# EAGLE schematic Vinduno-R-22-3-15 (EAGLE 7.1.0)
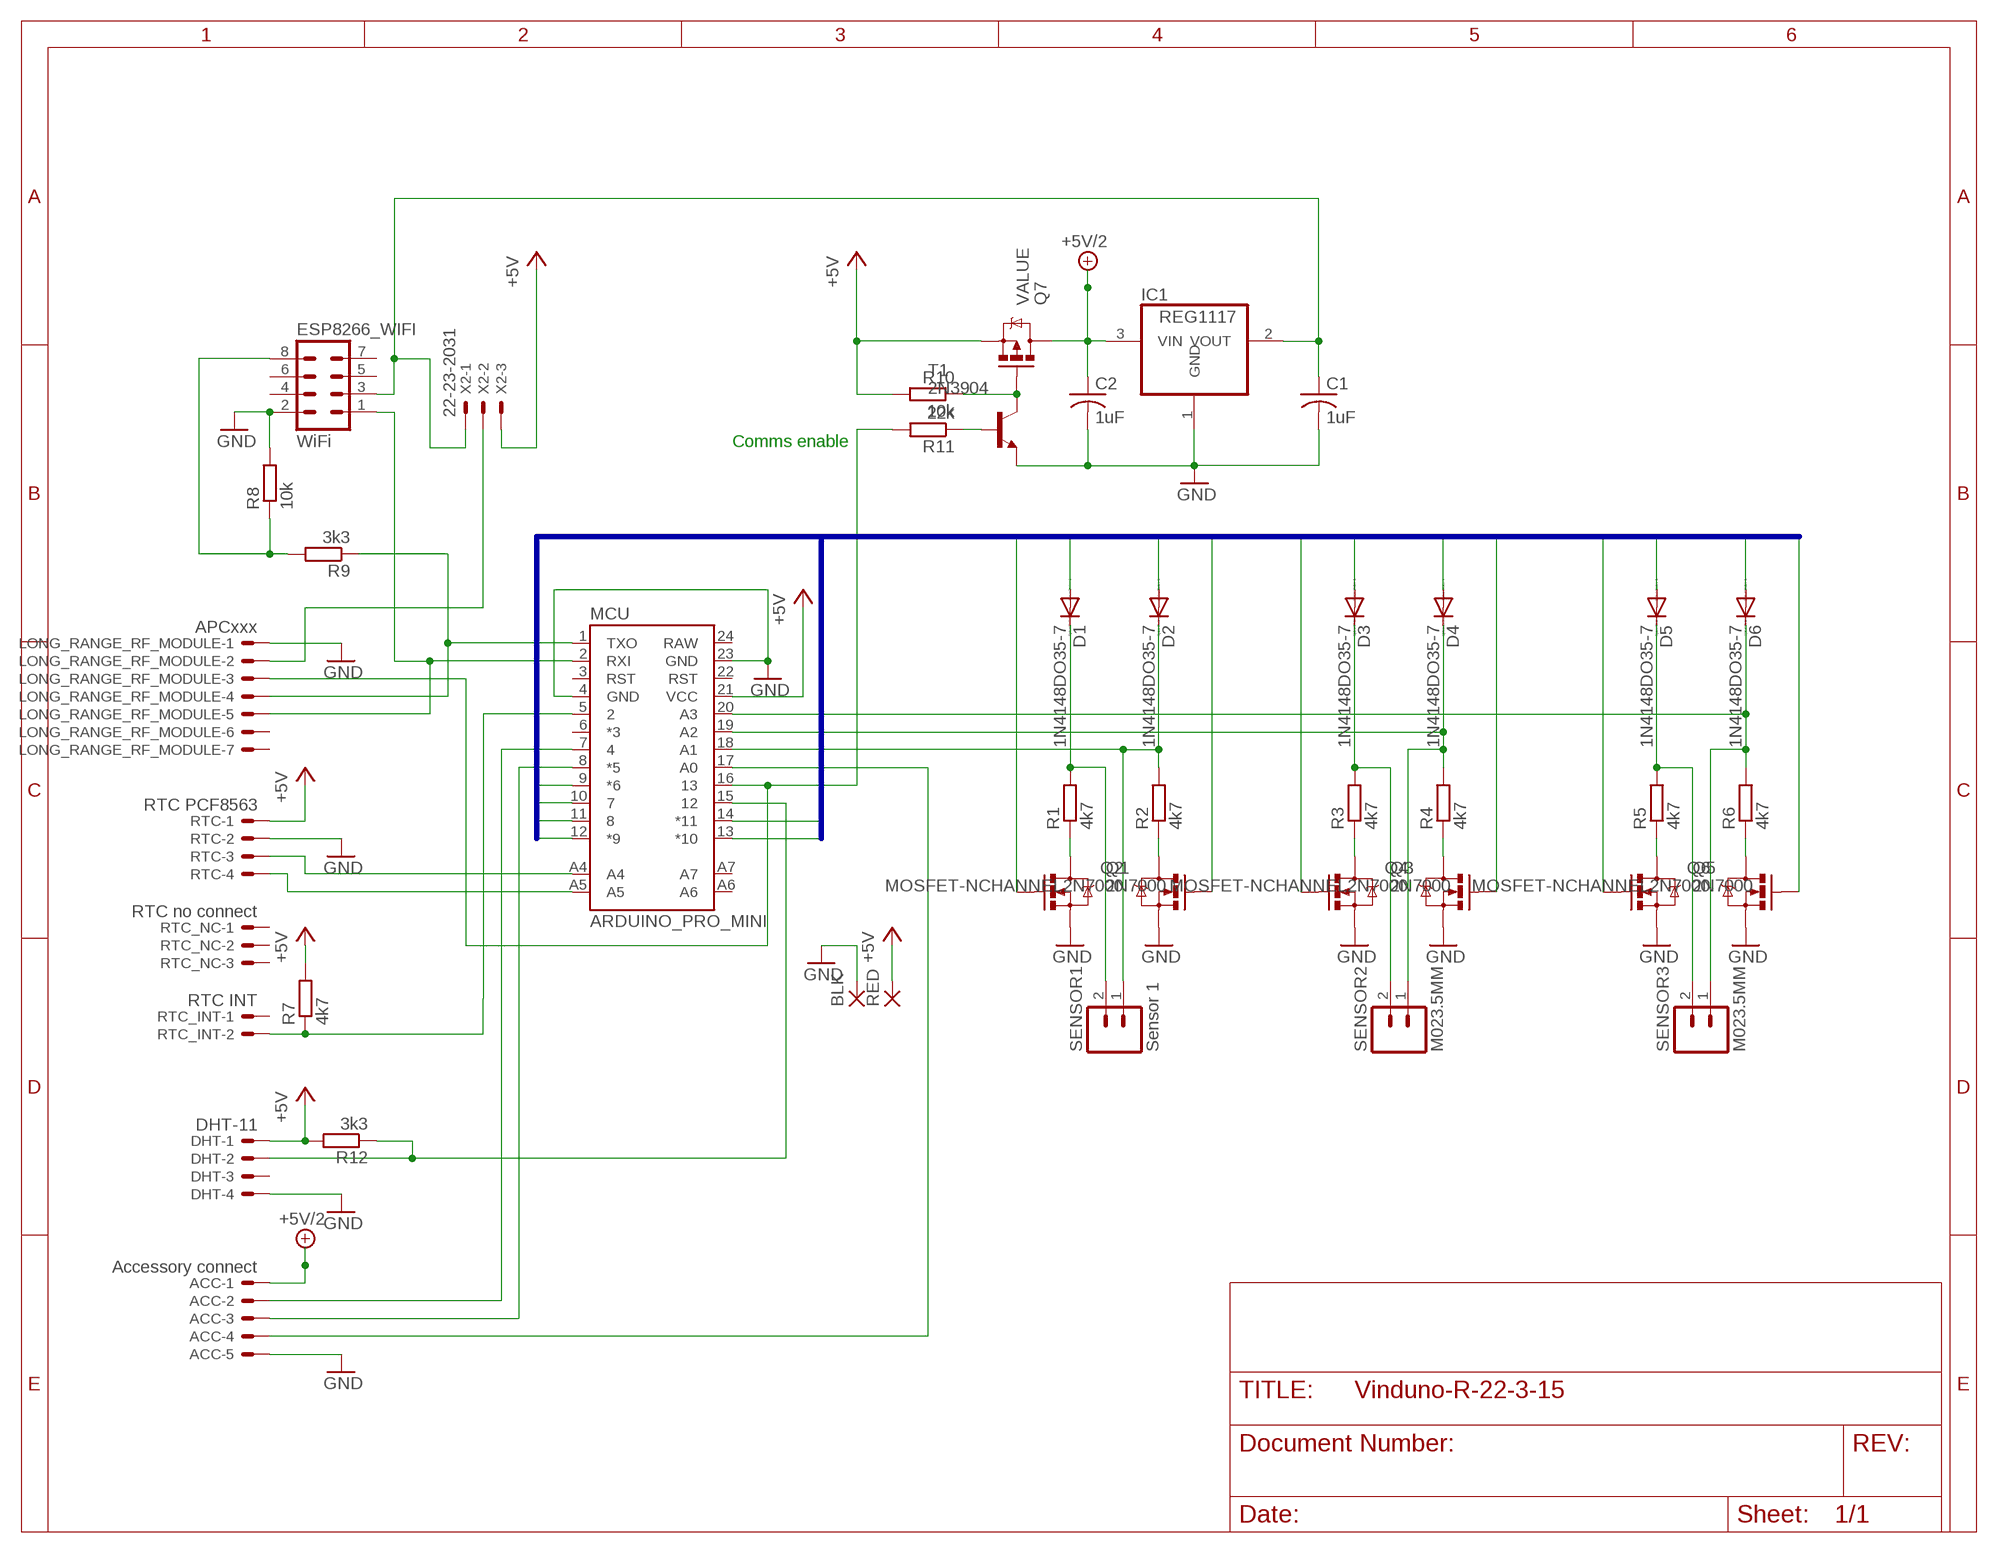
[diagram p0: schematic, sheet 1]

## Parts
ACC  Accessory connect  22-23-2051  [22-23-2051]
BLK  WIREPAD2,54/0,9  [2,54/0,9]
C1  1uF  C-US025-030X050  [C025-030X050]
C2  1uF  C-US025-030X050  [C025-030X050]
D1  1N4148DO35-7  [DO35-7]
D2  1N4148DO35-7  [DO35-7]
D3  1N4148DO35-7  [DO35-7]
D4  1N4148DO35-7  [DO35-7]
D5  1N4148DO35-7  [DO35-7]
D6  1N4148DO35-7  [DO35-7]
DHT  DHT-11  22-23-2041  [22-23-2041]
ESP8266_WIFI  WiFi  MA04-2  [MA04-2]
IC1  REG1117  [SOT223]
LONG_RANGE_RF_MODULE  APCxxx  22-23-2071  [22-23-2071]
MCU  ARDUINO_PRO_MINI  [ARDUINO_PRO_MINI]
Q1  2N7000  MOSFET-NCHANNEL2N7000  [TO-92]
Q2  MOSFET-NCHANNEL2N7000  [TO-92]
Q3  2N7000  MOSFET-NCHANNEL2N7000  [TO-92]
Q4  MOSFET-NCHANNEL2N7000  [TO-92]
Q5  2N7000  MOSFET-NCHANNEL2N7000  [TO-92]
Q6  MOSFET-NCHANNEL2N7000  [TO-92]
Q7  AO3401  MOSFET-PCHANNEL  [SOT23-3]
R1  4k7  R-EU_0204/7  [0204/7]
R2  4k7  R-EU_0204/7  [0204/7]
R3  4k7  R-EU_0204/7  [0204/7]
R4  4k7  R-EU_0204/7  [0204/7]
R5  4k7  R-EU_0204/7  [0204/7]
R6  4k7  R-EU_0204/7  [0204/7]
R7  4k7  R-EU_0204/7  [0204/7]
R8  10k  R-EU_0204/7  [0204/7]
R9  3k3  R-EU_0204/7  [0204/7]
R10  10k  R-EU_0204/7  [0204/7]
R11  22k  R-EU_0204/7  [0204/7]
R12  3k3  R-EU_0204/7  [0204/7]
RED  WIREPAD2,54/0,9  [2,54/0,9]
RTC  RTC PCF8563  22-23-2041  [22-23-2041]
RTC_INT  RTC INT  22-23-2021  [22-23-2021]
RTC_NC  RTC no connect  22-23-2031  [22-23-2031]
SENSOR1  Sensor 1  M023.5MM  [SCREWTERMINAL-3.5MM-2]
SENSOR2  M023.5MM  [SCREWTERMINAL-3.5MM-2]
SENSOR3  M023.5MM  [SCREWTERMINAL-3.5MM-2]
T1  2N3904  [TO92]
X2  22-23-2031  [22-23-2031]

## Nets
+5V [Supply]: DHT.1 MCU.21(VCC) Q7.2(S) R7.2 R10.2 R12.2 RED.1(P) RTC.1 X2.3
+5V/2 [Supply]: ACC.1 C2.1 IC1.3(VIN) Q7.3(D)
DIODE1: D1.A MCU.9(*6) Q2.2(G)
DIODE2: D2.A MCU.10 Q1.2(G)
DIODE3: D3.A MCU.11 Q4.2(G)
DIODE4: D4.A MCU.12(*9) Q3.2(G)
DIODE5: D5.A MCU.13(*10) Q6.2(G)
DIODE6: D6.A MCU.14(*11) Q5.2(G)
GND [Supply]: ACC.5 BLK.1(P) C1.2 C2.2 DHT.4 ESP8266_WIFI.2 IC1.1(GND) LONG_RANGE_RF_MODULE.1 MCU.4(GND) MCU.23(GND) Q1.1(S) Q2.1(S) Q3.1(S) Q4.1(S) Q5.1(S) Q6.1(S) R8.2 RTC.2 T1.3(E)
N$1: D1.C R1.2 SENSOR1.2
N$2: D2.C MCU.18(A1) R2.2 SENSOR1.1
N$3: D3.C R3.2 SENSOR2.2
N$4: D4.C MCU.19(A2) R4.2 SENSOR2.1
N$5: Q1.3(D) R1.1
N$6: D5.C R5.2 SENSOR3.2
N$7: D6.C MCU.20(A3) R6.2 SENSOR3.1
N$8: ACC.4 MCU.17(A0)
N$9: MCU.A4 RTC.3
N$10: LONG_RANGE_RF_MODULE.3 MCU.16 R11.2
N$11: LONG_RANGE_RF_MODULE.4 MCU.1(TXO) R9.1
N$12: ESP8266_WIFI.1 LONG_RANGE_RF_MODULE.5 MCU.2(RXI)
N$13: MCU.A5 RTC.4
N$14: Q2.3(D) R2.1
N$15: Q3.3(D) R3.1
N$16: Q4.3(D) R4.1
N$17: Q5.3(D) R5.1
N$18: Q6.3(D) R6.1
N$19: ESP8266_WIFI.8 R8.1 R9.2
N$20: DHT.2 MCU.15 R12.1
N$21: ACC.3 MCU.8(*5)
N$22: Q7.1(G) R10.1 T1.1(C)
N$23: R11.1 T1.2(B)
N$24: MCU.5 R7.1 RTC_INT.2
N$25: ACC.2 MCU.7
N$26 [Supply]: C1.1 ESP8266_WIFI.3 IC1.2(VOUT) X2.1
N$27: LONG_RANGE_RF_MODULE.2 X2.2
Unconnected: DHT.3 ESP8266_WIFI.4 ESP8266_WIFI.5 ESP8266_WIFI.6 ESP8266_WIFI.7 LONG_RANGE_RF_MODULE.6 LONG_RANGE_RF_MODULE.7 MCU.3(RST) MCU.6(*3) MCU.22(RST) MCU.24(RAW) MCU.A6 MCU.A7 RTC_INT.1 RTC_NC.1 RTC_NC.2 RTC_NC.3

## Buses
SENSORBUS:DIODE[1..6],A[0..3]

## Notes on the sheet
- Comms enable

## Library data of the parts
ACC = con-molex:22-23-2051: .100" (2.54mm) Center Header - 5 Pin; MF: MOLEX; MPN: 22-23-2051; OC_FARNELL: 1462952; OC_NEWARK: 38C9178
BLK RED = wirepad:WIREPAD: Wire PAD connect wire on PCB
C1 C2 = adafruit:C-US: CAPACITOR, American symbol
D1-D6 = diode:1N4148: DIODE high speed (Philips)
DHT = con-molex:22-23-2041: .100" (2.54mm) Center Header - 4 Pin; MF: MOLEX; MPN: 22-23-2041; OC_FARNELL: 1462920; OC_NEWARK: 38C0355
ESP8266_WIFI = con-lstb:MA04-2: PIN HEADER; OC_FARNELL: unknown; OC_NEWARK: unknown
IC1 = burr-brown:REG1117: 800mA and 1A Low Dropout (LDO) Positive Regulator 1.8V, 2.5V, 2.85V, 3.3V, 5V, and Adj; MPN: REG1117; OC_FARNELL: 1097566; OC_NEWARK: 14P6981
LONG_RANGE_RF_MODULE = con-molex:22-23-2071: .100" (2.54mm) Center Header - 7 Pin; MF: MOLEX; MPN: 22-23-2071; OC_FARNELL: 1654534; OC_NEWARK: 56H0445
MCU = SparkFun-Boards:ARDUINO_PRO_MINI
Q1-Q6 = SparkFun-DiscreteSemi:MOSFET-NCHANNEL: Common NMOSFET Parts MFG P/N Store ID Prod ID FDD8780 TRANS-09984 SI7820DN TRANS-11055 FDS6630A IC-08089 2N7002PW TRANS-11151 FQP30N06L COM-10213 TRANS-10060 BSS123LT1G TRANS-08345 BSS138 TRANS-00830 BS170 2N7000
Q7 = SparkFun-DiscreteSemi:MOSFET-PCHANNEL: Generic PMOSFET IRLML2244 - TRANS-11153 (SOT-23 -20V -4.3A) (1.Gate 2.Source 3.Drain) FQP27P06 - COM-10349 <http://www.sparkfun.com/products/10349> (TO-220 -60V -27A) (1.Gate 2.Source 3.Drain); PROD_ID: TRANS-08285
R1 R3-R12 = rcl:R-EU_: RESISTOR, European symbol; R1: 4k7
R2 = rcl:R-EU_: RESISTOR, European symbol; R2: 4k7
RTC = con-molex:22-23-2041: .100" (2.54mm) Center Header - 4 Pin; MF: MOLEX; MPN: RTC; OC_FARNELL: 1462920; OC_NEWARK: 38C0355
RTC_INT = con-molex:22-23-2021: .100" (2.54mm) Center Header - 2 Pin; MF: MOLEX; MPN: 22-23-2021; OC_FARNELL: 1462926; OC_NEWARK: 25C3832
RTC_NC X2 = con-molex:22-23-2031: .100" (2.54mm) Center Header - 3 Pin; MF: MOLEX; MPN: 22-23-2031; OC_FARNELL: 1462950; OC_NEWARK: 30C0862
SENSOR1-SENSOR3 = SparkFun-Connectors:M02: Standard 2-pin 0.1" header. Use with - straight break away headers ( PRT-00116) - right angle break away headers (PRT-00553) - swiss pins (PRT-00743) - machine pins (PRT-00117) - female headers (PRT-00115) Molex polarized connector foot print use with: PRT-08233 with associated crimp pins and housings. 2.54_SCREWTERM for use with PRT-10571. 3.5mm Screw Terminal footprints for PRT-08084 5mm Screw Terminal footprints for use with PRT-08432
T1 = transistor:2N3904: NPN TRANSISTOR

## Net classes
0 default: width 0.254 mm, clearance 0.205 mm
1 Supply: width 0.508 mm, clearance 0.508 mm